# Altium project PCB_Project1.PrjPCB
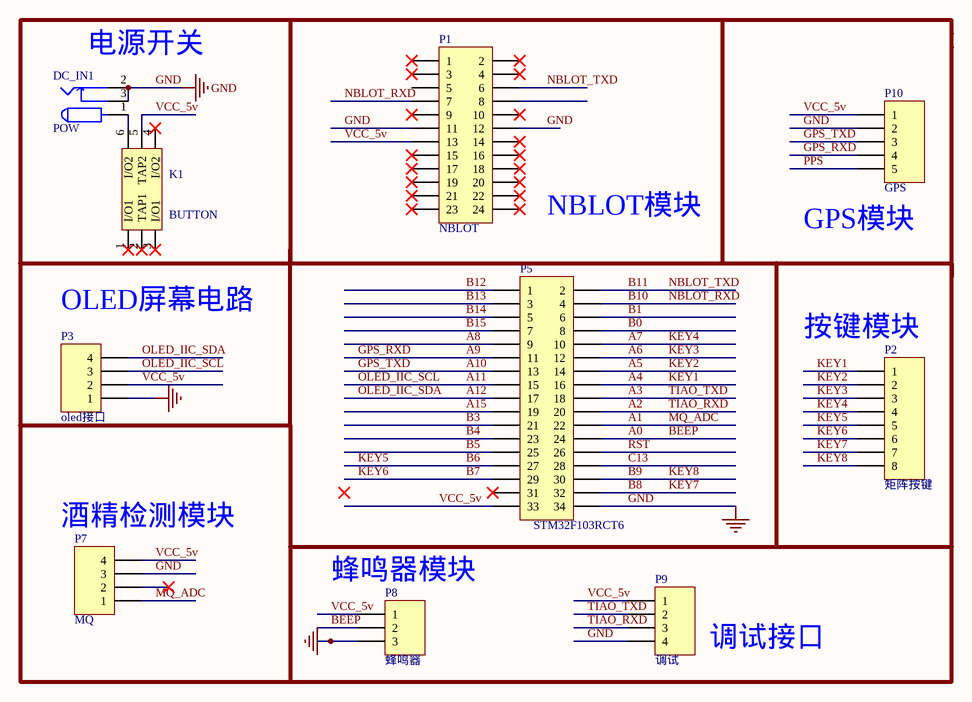
[diagram p0: Sheet1.SchDoc]
1 sheet, 10 parts. Net scope: global (net labels, ports and power ports of the same name join across sheets).
Board file: PCB1.PcbDoc

## Sheet Sheet1.SchDoc
size A

### Parts
DC_IN1  POW  [DC10B]
K1  BUTTON  [BTN8.5*8.5]
P1  NBLOT  [NBLOT]
P2  矩阵按键  [HDR1X8]
P3  oled接口  [HDR1X4]
P5  STM32F103RCT6  [stm32最小系统]
P7  MQ  [HDR1X4]
P8  蜂鸣器  [HDR1X3]
P9  调试  [HDR1X4]
P10  GPS  [HDR1X5]

### Nets
GND: DC_IN1.2 DC_IN1.3 P1.11 P1.12 P3.1 P5.34 P7.3 P8.3 P9.4 P10.2
A0: P5.24 P8.2  [also labelled BEEP]
A1: P5.22 P7.1  [also labelled MQ_ADC]
A2: P5.20 P9.3  [also labelled TIAO_RXD]
A3: P5.18 P9.2  [also labelled TIAO_TXD]
A4: P2.1 P5.16  [also labelled KEY1]
A5: P2.2 P5.14  [also labelled KEY2]
A6: P2.3 P5.12  [also labelled KEY3]
A7: P2.4 P5.10  [also labelled KEY4]
A8: P5.9
A9: P5.11 P10.4  [also labelled GPS_RXD]
A10: P5.13 P10.3  [also labelled GPS_TXD]
A11: P3.3 P5.15  [also labelled OLED_IIC_SCL]
A12: P3.4 P5.17  [also labelled OLED_IIC_SDA]
A15: P5.19
B0: P5.8
B1: P5.6
B3: P5.21
B4: P5.23
B5: P5.25
B6: P2.5 P5.27  [also labelled KEY5]
B7: P2.6 P5.29  [also labelled KEY6]
B8: P2.7 P5.32  [also labelled KEY7]
B9: P2.8 P5.30  [also labelled KEY8]
B10: P1.7 P5.4  [also labelled NBLOT_RXD]
B11: P1.6 P5.2  [also labelled NBLOT_TXD]
B12: P5.1
B13: P5.3
B14: P5.5
B15: P5.7
C13: P5.28
PPS: P10.5
RST: P5.26
VCC_5v: K1.5(TAP2) P1.13 P3.2 P5.33 P7.4 P8.1 P9.1 P10.1
NetDC_IN1_1: DC_IN1.1 K1.6(I/O2)

Not connected (* = marked no-connect by the designer): K1 1(I/O1)* 2(TAP1)* 3(I/O1)* 4(I/O2)*; P1 1* 2* 3* 4* 5 8 9* 10* 14* 15* 16* 17* 18* 19* 20* 21* 22* 23* 24*; P5 31*; P7 2*

### Notes on the sheet
- (near DC_IN1) 电源开关
- NBLOT模块
- (near P10) GPS模块
- OLED屏幕电路
- (near P2) 按键模块
- (near P7) 酒精检测模块
- (near P8) 蜂鸣器模块
- 调试接口

### Library data of the parts
P1 = Header 12X2: Header, 12-Pin, Dual row; LatestRevisionDate: 17-Jul-2002; LatestRevisionNote: Re-released for DXP Platform.; Publisher: Altium Limited
P2 = Header 8: Header, 8-Pin; LatestRevisionDate: 17-Jul-2002; LatestRevisionNote: Re-released for DXP Platform.; Publisher: Altium Limited
P3 P7 P9 = Header 4: Header, 4-Pin; LatestRevisionDate: 17-Jul-2002; LatestRevisionNote: Re-released for DXP Platform.; Publisher: Altium Limited
P5 = Header 17X2: Header, 17-Pin, Dual row; LatestRevisionDate: 17-Jul-2002; LatestRevisionNote: Re-released for DXP Platform.; Publisher: Altium Limited
P8 = Header 3: Header, 3-Pin; LatestRevisionDate: 17-Jul-2002; LatestRevisionNote: Re-released for DXP Platform.; Publisher: Altium Limited
P10 = Header 5: Header, 5-Pin; LatestRevisionDate: 17-Jul-2002; LatestRevisionNote: Re-released for DXP Platform.; Publisher: Altium Limited